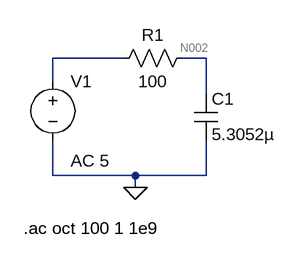
[diagram p0: schematic Draft1.asc]
Draft1.asc, the LTspice schematic file:
Version 4.1
SHEET 1 880 680
WIRE 192 80 96 80
WIRE 304 80 272 80
WIRE 96 112 96 80
WIRE 304 128 304 80
WIRE 96 240 96 192
WIRE 208 240 96 240
WIRE 304 240 304 192
WIRE 304 240 208 240
WIRE 208 256 208 240
FLAG 208 256 0
SYMBOL voltage 96 96 R0
WINDOW 123 24 124 Left 2
WINDOW 39 0 0 Left 0
SYMATTR InstName V1
SYMATTR Value ""
SYMATTR Value2 AC 5
SYMBOL res 288 64 R90
WINDOW 0 0 56 VBottom 2
WINDOW 3 32 56 VTop 2
SYMATTR InstName R1
SYMATTR Value 100
SYMBOL cap 288 128 R0
SYMATTR InstName C1
SYMATTR Value 5.3052µ
TEXT 56 312 Left 2 !.ac oct 100 1 1e9

The netlist it stands for:
* Draft1.asc
V1 N001 0 AC 5
R1 N002 N001 100
C1 N002 0 5.3052µ
.ac oct 100 1 1e9
.backanno
.end

* Results of the author's LTspice run, read from the files saved beside the schematic
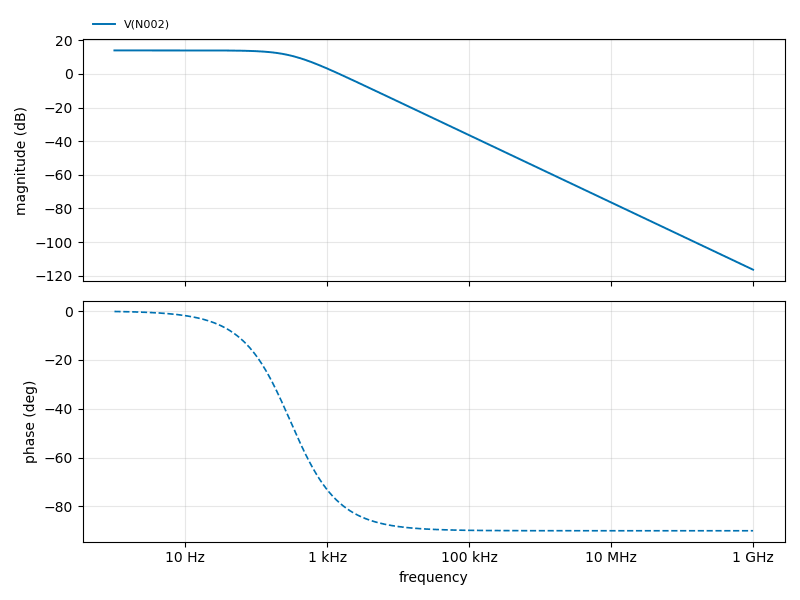
[diagram p1: AC Analysis of Draft1.asc, plotted from the saved traces]
* AC Analysis, 1 run:
*   V(N002): 13.98 dB at 1 Hz, -116.47 dB at 1 GHz, peak 13.98 dB at 1 Hz, 3 dB below the peak at 300.3 Hz